# Altium schematic sheet Qunyin_mmWave_pmic.SchDoc: mmWave_iwr6843aop
size 457 x 292 mm; DrawnBy: Wxd; Organization: Shanghai Qunyin; Address1: Xianxia Rd 601; Address2: Changning district; Address3: Shanghai; DocumentNumber: 3; SheetNumber: 3; SheetTotal: 6
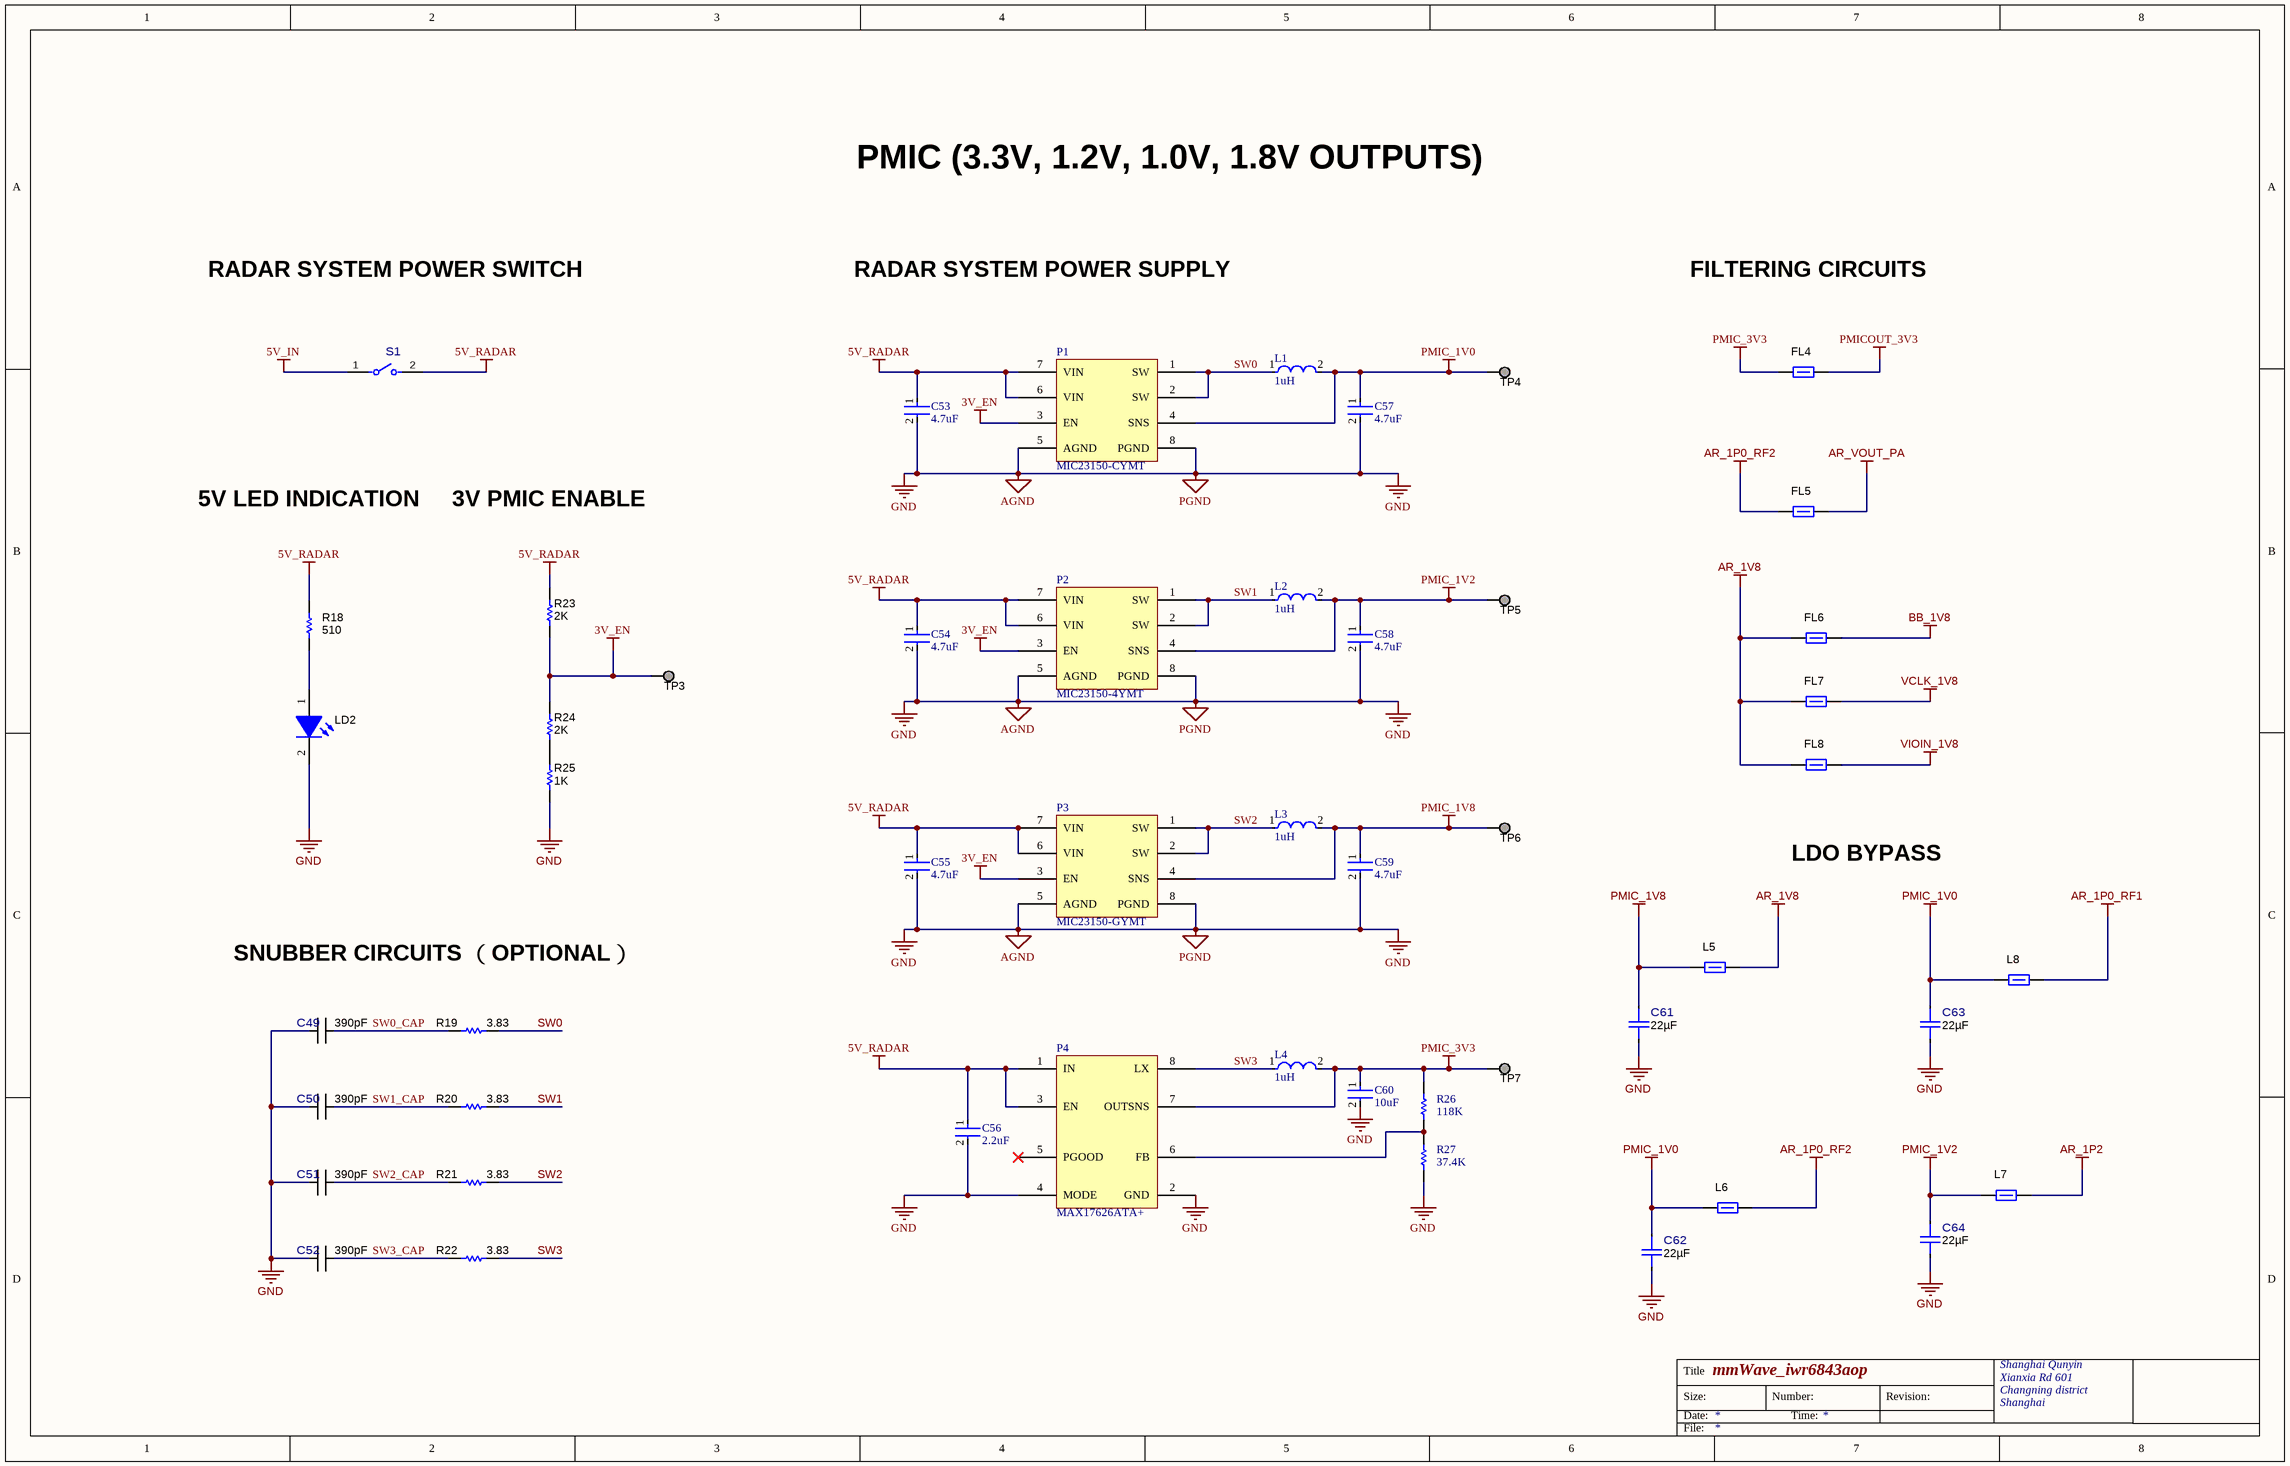
[diagram p0: Qunyin_mmWave_pmic.SchDoc]

## Parts
C49  Cap_F: 390pF  [FP-TMK063CG391JT-F_0201 (0603 Metric)-IPC_C]  (hidden comment: TMK063CG391JT-F)
C50  Cap_F: 390pF  [FP-TMK063CG391JT-F_0201 (0603 Metric)-IPC_C]  (hidden comment: TMK063CG391JT-F)
C51  Cap_F: 390pF  [FP-TMK063CG391JT-F_0201 (0603 Metric)-IPC_C]  (hidden comment: TMK063CG391JT-F)
C52  Cap_F: 390pF  [FP-TMK063CG391JT-F_0201 (0603 Metric)-IPC_C]  (hidden comment: TMK063CG391JT-F)
C53  Capacitance: 4.7uF  [FP-CL10-IPC_C]  (hidden comment: CL10B475KQ8NQNC)
C54  Capacitance: 4.7uF  [FP-CL10-IPC_C]  (hidden comment: CL10B475KQ8NQNC)
C55  Capacitance: 4.7uF  [FP-CL10-IPC_C]  (hidden comment: CL10B475KQ8NQNC)
C56  Capacitance: 2.2uF  [FP-GRM188-0_1-e0_2_0_5-MFG]  (hidden comment: GRM188R71A225KE15D)
C57  Capacitance: 4.7uF  [FP-CL10-IPC_C]  (hidden comment: CL10B475KQ8NQNC)
C58  Capacitance: 4.7uF  [FP-CL10-IPC_C]  (hidden comment: CL10B475KQ8NQNC)
C59  Capacitance: 4.7uF  [FP-CL10-IPC_C]  (hidden comment: CL10B475KQ8NQNC)
C60  capacitance: 10uF  [FP-GRM188-0_2-IPC_C]  (hidden comment: GRM188Z71A106KA73D)
C61  Cap_F: 22µF  [FP-CL05A226MQ5N6J8_0402-IPC_C]  (hidden comment: CL05A226MQ5N6J8)
C62  Cap_F: 22µF  [FP-CL05A226MQ5N6J8_0402-IPC_C]  (hidden comment: CL05A226MQ5N6J8)
C63  Cap_F: 22µF  [FP-CL05A226MQ5N6J8_0402-IPC_C]  (hidden comment: CL05A226MQ5N6J8)
C64  Cap_F: 22µF  [FP-CL05A226MQ5N6J8_0402-IPC_C]  (hidden comment: CL05A226MQ5N6J8)
FL4  BLM15PD300SZ1D  [0402L]  (value not drawn)
FL5  BLM15PD300SZ1D  [0402L]  (value not drawn)
FL6  BLM15PD300SZ1D  [0402L]  (value not drawn)
FL7  BLM15PD300SZ1D  [0402L]  (value not drawn)
FL8  BLM15PD300SZ1D  [0402L]  (value not drawn)
L1  Inductance: 1uH  [FP-LQH5BPB_T0-MFG]  (hidden comment: LQH5BPN1R0NT0L)
L2  Inductance: 1uH  [FP-LQH5BPB_T0-MFG]  (hidden comment: LQH5BPN1R0NT0L)
L3  Inductance: 1uH  [FP-LQH5BPB_T0-MFG]  (hidden comment: LQH5BPN1R0NT0L)
L4  Inductance: 1uH  [FP-LQH5BPB_T0-MFG]  (hidden comment: LQH5BPN1R0NT0L)
L5  BLM18SG260TN1D  [0603L]  (value not drawn)
L6  BLM18SG260TN1D  [0603L]  (value not drawn)
L7  BLM18SG260TN1D  [0603L]  (value not drawn)
L8  BLM18SG260TN1D  [0603L]  (value not drawn)
LD2  APHHS1005CGCK  [APHHS1005_Green]  (value not drawn)
P1  MIC23150-CYMT
P2  MIC23150-4YMT
P3  MIC23150-GYMT
P4  MAX17626ATA+
R18  value 510  [0201L]  (hidden comment: RC0201JR-07510RL)
R19  Res_ohm: 3.83  [FP-RC0402FR-073R83L_0402 (1005 Metric)-IPC_C]  (hidden comment: RC0402FR-073R83L)
R20  Res_ohm: 3.83  [FP-RC0402FR-073R83L_0402 (1005 Metric)-IPC_C]  (hidden comment: RC0402FR-073R83L)
R21  Res_ohm: 3.83  [FP-RC0402FR-073R83L_0402 (1005 Metric)-IPC_C]  (hidden comment: RC0402FR-073R83L)
R22  Res_ohm: 3.83  [FP-RC0402FR-073R83L_0402 (1005 Metric)-IPC_C]  (hidden comment: RC0402FR-073R83L)
R23  value 2K  [FP-RMCF0603-IPC_A]  (hidden comment: Stackpole Electronics RMCF0603FT2K00)
R24  value 2K  [FP-RMCF0603-IPC_A]  (hidden comment: Stackpole Electronics RMCF0603FT2K00)
R25  value 1K  [FP-RMCF0603-IPC_A]  (hidden comment: Samsung RC0603J102CS)
R26  value 118K  [FP-CRCW1206-e3-IPC_A]  (hidden comment: Vishay CRCW1206118KFKEA)
R27  value 37.4K  [FP-CRCW1206-e3-IPC_A]  (hidden comment: Panasonic ERJ-8ENF3742V)
S1  CHS-01TA  [FP-CHS-01TA_SMT_SW_5MM4_2MM5-MFG]  (value not drawn)
TP3  TESTPOINT  [TP_25MIL-SMT]  (value not drawn)  (no BOM)
TP4  TESTPOINT  [TP_25MIL-SMT]  (value not drawn)  (no BOM)
TP5  TESTPOINT  [TP_25MIL-SMT]  (value not drawn)  (no BOM)
TP6  TESTPOINT  [TP_25MIL-SMT]  (value not drawn)  (no BOM)
TP7  TESTPOINT  [TP_25MIL-SMT]  (value not drawn)  (no BOM)

## Nets
3V_EN: P1.3(EN) P2.3(EN) P3.3(EN) R23.1 R24.2 TP3.1
5V_IN: S1.1
5V_RADAR: C53.1 C54.1 C55.1 C56.1 P1.6(VIN) P1.7(VIN) P2.6(VIN) P2.7(VIN) P3.6(VIN) P3.7(VIN) P4.1(IN) P4.3(EN) R18.1 R23.2 S1.2
AGND: C49.2 C50.2 C51.2 C52.2 C53.2 C54.2 C55.2 C56.2 C57.2 C58.2 C59.2 C60.2 C61.2 C62.2 C63.2 C64.2 LD2.2(K) P1.5(AGND) P1.8(PGND) P2.5(AGND) P2.8(PGND) P3.5(AGND) P3.8(PGND) P4.2(GND) P4.4(MODE) R25.1 R27.1  [also labelled GND, PGND]
AR_1P0_RF1: L8.2
AR_1P0_RF2: FL5.1 L6.2
AR_1P2: L7.2
AR_1V8: FL6.1 FL7.1 FL8.1 L5.2
AR_VOUT_PA: FL5.2
BB_1V8: FL6.2
PMIC_1V0: C57.1 C62.1 C63.1 L1.2 L6.1 L8.1 P1.4(SNS) TP4.1
PMIC_1V2: C58.1 C64.1 L2.2 L7.1 P2.4(SNS) TP5.1
PMIC_1V8: C59.1 C61.1 L3.2 L5.1 P3.4(SNS) TP6.1
PMIC_3V3: C60.1 FL4.1 L4.2 P4.7(OUTSNS) R26.2 TP7.1
PMICOUT_3V3: FL4.2
VCLK_1V8: FL7.2
VIOIN_1V8: FL8.2
SW0: L1.1 P1.1(SW) P1.2(SW) R19.2
SW0_CAP: C49.1 R19.1
SW1: L2.1 P2.1(SW) P2.2(SW) R20.2
SW1_CAP: C50.1 R20.1
SW2: L3.1 P3.1(SW) P3.2(SW) R21.2
SW2_CAP: C51.1 R21.1
SW3: L4.1 P4.8(LX) R22.2
SW3_CAP: C52.1 R22.1
NetLD2_1: LD2.1(A) R18.2
NetP4_6: P4.6(FB) R26.1 R27.2
NetR24_1: R24.1 R25.2

Not connected (* = marked no-connect by the designer): P4 5(PGOOD)*

## Notes on the sheet
- PMIC (3.3V, 1.2V, 1.0V, 1.8V OUTPUTS)
- RADAR SYSTEM POWER SWITCH
- RADAR SYSTEM POWER SUPPLY
- FILTERING CIRCUITS
- 5V LED INDICATION
- 3V PMIC ENABLE
- LDO BYPASS
- SNUBBER CIRCUITS （OPTIONAL）
- Title
- Size:
- Date:
- Number:
- Time:
- Revision:
- File:

## Library data of the parts
C49-C52 = CMP-0086438-1: CAP CER 390PF 25V C0G/NP0 0201; Manufacturer: Taiyo Yuden; AEC Qualified: No; SizeZ_mm: 0.33mm; Symbol Name: SYM-TMK063CG391JT-F; TempCo: 30ppm/°C; Tolerance_%: 5%; RoHS: TRUE; ComponentLink1Description: Datasheet; ComponentLink1URL: https://ds.yuden.co.jp/TYCOMPAS/ut/download?pn=TMK063CG391JT-F+&fileType=CA; PackageReference: 0201 (0603 Metric); PartNumber: TMK063CG391JT-F; VDC_V: 25V
C53-C55 C57-C59 = CMP-2000-06096-2: CAP CER 4.7UF 6.3V X7R 0603; Manufacturer: Samsung; Tolerance: 10%; Material: Ceramic; Temperature Coefficient: 15%; Device Class L3: Ceramic Capacitors; Temperature Characteristic: X7R; Automotive: No; Package: CL10; Device Class L2: Capacitors; Octopart: https://octopart.com/cl10b475kq8nqnc-samsung-24957976; ComponentLink2Description: Datasheet; Temperature Range High: +125°C; Lead Free: Yes; Height: 0.95mm; Temperature: -55°C to +125°C; Ipc Land Pattern Name: CAPC16080X80; Temperature Range Low: -55°C; Digikey Description: CAP CER 4.7UF 6.3V X7R 0603; Mouser Description: C Series 0402 4.7 uF 6.3 V ±20 % Tolerance X5R SMT Multilayer Ceramic Capacitor; Category: Cap; ComponentLink2URL: http://www.samsungsem.com/kr/support/product-search/mlcc/__icsFiles/afieldfile/2018/07/24/CL10B475KQ8NQNC.pdf; Value: 4.7uF; Voltage Rating: 6.3V; Manufacturer Part Number: CL10B475KQ8NQNC; Device Class L1: Passive Components; RoHS: TRUE
C56 = CMP-2006-02836-2: Chip Multilayer Ceramic Capacitors for General Purpose, 0603, 2.2uF, X7R, 15%, 10%, 10V; Case Code (Metric): 1608; Height: 0.8mm; Packaging: Cut Tape; Voltage: 10V; Lead Free: Lead Free; Min Operating Temperature: -55°C; Voltage Rating (DC): 10V; Max Operating Temperature: 125°C; Voltage Rating: 10V; Dielectric: X7R; Depth: 0.8mm; Case Code (Imperial): 0603; Termination: SMD/SMT; Case/Package: 0603; Number of Pins: 2; REACH SVHC: No SVHC; Mount: Surface Mount; Width: 0.031inch; Material: Ceramic; Package Quantity: 1; Weight: 7.1E-05oz; Length: 1.6mm; Thickness: 0.035inch; Tolerance: 10%
C60 = CMP-06035-000049-2: Chip Multilayer Ceramic Capacitors for General Purpose, 0603, 10uF, X7R, 15%, 10%, 10V
C61-C64 = CMP-0089043-3: CAP CER 22UF 6.3V X5R 0402; Manufacturer: Samsung Electro-Mechanics; TempCo: 15%; AEC Qualified: No; Tolerance_%: 20%; SizeZ_mm: 0.55mm; ComponentLink1URL: http://www.samsungsem.com/kr/support/library/product-catalog/__icsFiles/afieldfile/2018/11/28/MLCC.pdf; RoHS: TRUE; PartNumber: CL05A226MQ5N6J8; ComponentLink1Description: Datasheet; PackageReference: 0402; VDC_V: 6.3V; ValueDisplayed: 22uF; Part Number: CL05A226MQ5N6J8
FL4-FL8 = CMP-0078934-1: Inductor, Ferrite Bead, Ferrite, 2.2 A, 0.035 ohm, AEC-Q200 Grade 1, SMD; Manufacturer: MuRata; AEC Category: Q200; AEC Grade: 1; AEC Qualified: Y; DCR_ohm: 0.035; Imax_A: 2.2A; SizeArea_mm2: 0.5; SizeAreaWB_mm2: 3; SizeZ_mm: 0.6; RoHS: Y; ComponentLink1Description: Datasheet link; ComponentLink1URL: https://www.murata.com/en-us/products/productdata/8796748677150/QNFA9118.pdf; CompType: Inductor; LatestRevisionDate: 2017-12-07; Material: Ferrite; MountType: SMT; PackageReference: 0402; PartNumber: BLM15PD300SZ1D; Published: 2008-06-26; Publisher: Texas Instruments; SizeX_mm: 1; SizeY_mm: 0.5; Supplier 1: Digi-Key; Supplier 2: Mouser; Supplier Part Number 1: 490-16506-1-ND; Supplier Part Number 2: 81-BLM15PD300SZ1D; Technology: Ferrite Bead; Value1: 0.035 ohm; Value2: 2.2A
L1-L4 = CMP-06042-011330-1: Wire Wound Ferrite Inductor for Power Lines 1μH ±30% 0.0228Ω 3.1A 2020; Max DC Current: 5.8A; Test Frequency: 100kHz; Self Resonant Frequency: 90MHz; Shielding: Shielded; DC Resistance (DCR): 19mR; Tolerance: 30%; Resistor Type: Wirewound; Max Operating Temperature: 85°C; Inductance Tolerance: 30%; Case/Package: 2020; Lead Free: Lead Free; Mount: Surface Mount; Core Material: Ferrite; Military Standard: Not; Termination: SMD/SMT; Case Code (Imperial): 2020; Min Operating Temperature: -40°C; Length: 0.197inch; Package Quantity: 500; Height - Seated (Max): 0.086inch; Height: 2mm; Case Code (Metric): 5050; Width: 0.197inch; Depth: 5.2mm; REACH SVHC: No SVHC; Saturation Current: 5.8A; Packaging: Tape and Reel; Current Rating: 3.1A; DC Current: 3.1A
  L1: Parameter 1: *
L5-L8 = CMP-0003354-2: Ferrite Bead, 26 ohm @ 100 MHz, 6 A, 0603; Manufacturer: MuRata; ZTyp@100MHz_Ohm: 26; SizeAreaWB_mm2: 4.68; DCR_ohm: 7m; Value1: 0.007 ohm; Value: 26 ohm; Imax_A: 6A; SizeZ_mm: 1; SizeX_mm: 1.6; SizeY_mm: 0.8; SizeArea_mm2: 1.28; ComponentLink1URL: http://search.murata.co.jp/Ceramy/image/img/PDF/ENG/L0110S0100BLM18S.pdf; Supplier Part Number 2: 73M9124; Publisher: Texas Instruments; Supplier 2: Newark; Supplier Part Number 3: 81-BLM18SG260TN1D; Supplier 3: Mouser; Published: 2014-04-30; RoHS: Y; MountType: SMT; Supplier 1: Digi-Key; PackageReference: 0603; Value2: 6A; CompType: Ferrite Bead; LatestRevisionDate: 2017-03-09; PartNumber: BLM18SG260TN1D; ComponentLink1Description: Datasheet link; Supplier Part Number 1: 490-3995-1-ND; ValueDisplayed: 26 ohm
LD2 = CMP-0067682-2: LED, Green, SMD; Manufacturer: Kingbright; Angle: 120.0; Power_TotalModule: 75mW; SizeZ_mm: 0.6; Vf_V: 2.1V; Vr_V: 5V; Io_A: 20mA; Ir_A: 10µA; SizeArea_mm2: 0.5; SizeAreaWB_mm2: 3.0; SizeX_mm: 1.0; Tjmax_C: 85°C; Value1: 0.075W; RoHS: Y; Color: Green; ComponentLink1Description: Datasheet link; ComponentLink1URL: http://www.kingbrightusa.com/images/catalog/SPEC/APHHS1005CGCK.pdf; PackageReference: 0402; PartNumber: APHHS1005CGCK; CompType: LED; MountType: SMT; SizeY_mm: 0.5; Type: ?; Value2: 2.1V; Value: Green
P1 = MIC23150-CYMT: pmic 1V 2A 4MHz
P2 = MIC23150-4YMT: pmic 1.2V 2A 4MHz
P3 = MIC23150-GYMT: pmic 1.8V 2A 4MHz
P4 = MAX17626: IC 3.3V Adj Out Dc-dc Tdfn; Manufacturer: Analog Devices; Supplier 1: DigiKey; Supplier Part Number 1: 175-MAX17626ATA+-ND; Manufacturer Part Number: MAX17626ATA+
R18 = CMP-0027137-1: RES, 510, 5%, 0.05 W, 0201; Manufacturer: Yageo America; AEC Category: Q200; AEC Qualified: N; EIA_Code: E24; Power_W: 50mW; SizeArea_mm2: 0.18; SizeX_mm: 0.6; SizeY_mm: 0.3; SizeZ_mm: 0.26; TempCo: 200 ppm/C; U/M: EA; Value2: 0.05W; Value_Code: 510R; VDC_V: 25V; RoHS: Y; AEC Grade: N/A; ComponentLink1Description: Datasheet link; ComponentLink1URL: http://www.yageo.com/documents/recent/PYu-RC_Group_51_RoHS_L_5.pdf; CompType: Resistor; LatestRevisionDate: 2017-03-09; MountType: SMT; PackageReference: 0201; PartNumber: RC0201JR-07510RL; Published: 2016-10-14; Publisher: Texas Instruments; Res_ohm: 510; Supplier 1: Digi-Key; Supplier 2: Mouser; Supplier Part Number 1: YAG2907CT-ND; Supplier Part Number 2: 603-RC0201JR-07510RL; Technology: Thick Film; Tolerance_%: 5%; Value1: 5%; ValueDisplayed: 510
R19-R22 = CMP-0086444-2: RES Thick Film SMD 3.83Ω 1% 1/16W 0402 200ppm/°C; Manufacturer: Yageo; AEC Qualified: No; Power_W: 63mW; VDC_V: 50V; SizeZ_mm: 0.4mm; ComponentLink1Description: Datasheet; PackageReference: 0402 (1005 Metric); TempCo: 200ppm/°C; RoHS: TRUE; Technology: Thick Film; PartNumber: RC0402FR-073R83L; ComponentLink1URL: http://www.yageo.com/documents/recent/PYu-RC_Group_51_RoHS_L_10.pdf; Tolerance_%: 1%
R23 R24 = Resistor: Res Thick Film 0603 2K Ohm 1% 0.1W(1/10W) ±100ppm/C Pad SMD Automotive T/R; Resistance: 2kR; Power Rating: 100mW; Temperature Coefficient: 100ppm/°C; Working Voltage: 75V; Supplier 1: Arrow Electronics; Supplier Part Number 1: RMCF0603FT2K00; Manufacturer: Stackpole Electronics; Manufacturer Part Number: RMCF0603FT2K00; RoHS: Yes; Category: Chip SMD Resistors; Stock 1: 210000; Pricing 1: 5000=0.00220, 10000=0.00210, 25000=0.00180 (USD); Mount: Surface Mount; Case/Package: 0603; Case Code (Metric): 1608; Case Code (Imperial): 0603; Contact Plating: Tin,Matte; Min Operating Temperature: -55°C; Max Operating Temperature: 155°C; Tolerance: 1%; Packaging: Tape and Reel; Resistor Type: Thick Film; Number of Terminations: 2; Max Power Dissipation: 100mW; Features: Automotive AEC-Q200; Series: RMCF; Technology: THICK FILM; Construction: Rectangular; Length: 1.55mm; Width: 0.031inch; Height: 0.022inch; Depth: 0.8mm; Radiation Hardening: No; Military Standard: Not; Lead Free: Lead Free; RoHS Compliant: Yes; ComponentLink1URL: https://datasheet.ciiva.com/15193/getdatasheetpartid-362041-15193463.pdf?src-supplier=Verical; ComponentLink1Description: https://datasheet.ciiva.com/15193/getdatasheetpartid-362041-15193463.pdf?src-supplier=Verical
R25 = Resistor: Res Thick Film 0201 1K Ohm 5% 0.05W(1/20W) ±250ppm/C Pad SMD T/R; Resistance: 1kR; Temperature Coefficient: 200ppm/°C; Power Rating: 50mW; Supplier 1: Arrow Electronics; Supplier Part Number 1: RC0603J102CS; Manufacturer: Samsung; Manufacturer Part Number: RC0603J102CS; RoHS: Yes; Category: Chip SMD Resistors; Stock 1: 11797; Pricing 1: 1=0.04340, 10=0.01620, 50=0.01600, 100=0.00940, 250=0.00640, 1000=0.00380, 3000=0.00350, 6000=0.00330 (USD); Case/Package: 0201; Contact Plating: Tin; Case Code (Metric): 0603; Case Code (Imperial): 0201; Size Code: 0201; Min Operating Temperature: -55°C; Max Operating Temperature: 125°C; Tolerance: 5%; Resistor Type: Thick Film; Packaging: Tape and Reel; Number of Terminations: 2; Max Power Dissipation: 50mW; Features: Moisture Resistant; Series: RC; Construction: Rectangular; Length: 0.024inch; Width: 0.012inch; Height: 0.01inch; Depth: 0.3mm; Radiation Hardening: No; Military Standard: Not; RoHS Compliant: Yes; ComponentLink1URL: https://datasheet.ciiva.com/26134/chip-resistor-150112-1-26134188.pdf?src-supplier=Digi-Key; ComponentLink1Description: https://datasheet.ciiva.com/26134/chip-resistor-150112-1-26134188.pdf?src-supplier=Digi-Key
R26 = Resistor: Res Thick Film 1206 118K Ohm 1% 1/4W ±100ppm/°C Molded SMD SMD Paper T/R; Power Rating: 250mW; Resistance: 118kR; Voltage Rating: 200V; Supplier 1: Newark; Supplier Part Number 1: 28W4162; Manufacturer: Vishay; Manufacturer Part Number: CRCW1206118KFKEA; RoHS: Yes; Category: Chip SMD Resistors; Stock 1: 283; Pricing 1: 10=0.09700, 25=0.07700, 50=0.05700, 100=0.03700 (USD); Case/Package: 1206; Number of Pins: 2; Case Code (Metric): 3216; Case Code (Imperial): 1206; Contact Plating: Tin; Weight: 0.000353oz; Size Code: 1206; Min Operating Temperature: -55°C; Max Operating Temperature: 155°C; Tolerance: 1%; Packaging: Tape and Reel; Resistor Type: Thick Film; Temperature Coefficient: 100ppm/°C; Series: CRCW; Number of Terminations: 2; Max Power Dissipation: 250mW; Voltage Rating (DC): 200V; Package Quantity: 10; Termination: SMD/SMT; Resistance Tolerance: 1%; Features: Automotive AEC-Q200; Construction: Rectangular; Length: 3.2mm; Width: 0.063inch; Height: 0.024inch; Depth: 1.6mm; Radiation Hardening: No; RoHS Compliant: Yes; REACH SVHC: Unknown; Lead Free: Lead Free; Military Standard: Not; ComponentLink1URL: https://datasheet.ciiva.com/5542/dcrcwe3-109170-5542060.pdf?src-supplier=Mouser; ComponentLink1Description: https://datasheet.ciiva.com/5542/dcrcwe3-109170-5542060.pdf?src-supplier=Mouser; ComponentLink2URL: https://datasheet.ciiva.com/8976/dcrcwe3-8976345.pdf?src-supplier=Avnet; ComponentLink2Description: https://datasheet.ciiva.com/8976/dcrcwe3-8976345.pdf?src-supplier=Avnet; ComponentLink3URL: https://datasheet.ciiva.com/2497/dcrcwe3-2497327.pdf?src-supplier=Digi-Key; ComponentLink3Description: https://datasheet.ciiva.com/2497/dcrcwe3-2497327.pdf?src-supplier=Digi-Key; ComponentLink4URL: https://datasheet.ciiva.com/2497/dcrcwe3-2497328.pdf?src-supplier=Digi-Key; ComponentLink4Description: https://datasheet.ciiva.com/2497/dcrcwe3-2497328.pdf?src-supplier=Digi-Key; ComponentLink5URL: https://datasheet.ciiva.com/2497/dcrcwe3-2497329.pdf?src-supplier=Digi-Key; ComponentLink5Description: https://datasheet.ciiva.com/2497/dcrcwe3-2497329.pdf?src-supplier=Digi-Key; ComponentLink6URL: https://datasheet.ciiva.com/7800/125364-7800553.pdf?src-supplier=Element14; ComponentLink6Description: https://datasheet.ciiva.com/7800/125364-7800553.pdf?src-supplier=Element14; ComponentLink7URL: https://datasheet.ciiva.com/22675/1847332-22675213.pdf?src-supplier=Element14; ComponentLink7Description: https://datasheet.ciiva.com/22675/1847332-22675213.pdf?src-supplier=Element14; ComponentLink8URL: https://datasheet.ciiva.com/7714/1697337-7714310.pdf?src-supplier=Element14; ComponentLink8Description: https://datasheet.ciiva.com/7714/1697337-7714310.pdf?src-supplier=Element14; ComponentLink9URL: https://datasheet.ciiva.com/7714/1697337-7714311.pdf?src-supplier=Element14; ComponentLink9Description: https://datasheet.ciiva.com/7714/1697337-7714311.pdf?src-supplier=Element14
R27 = Resistor: Res Thick Film 1206 37.4K Ohm 1% 1/4W ±100ppm/°C Molded SMD Punched Carrier T/R; Resistance: 37.4kR; Power Rating: 250mW; Voltage Rating (DC): 200V; Supplier 1: Arrow Electronics; Supplier Part Number 1: ERJ-8ENF3742V; Manufacturer: Panasonic; Manufacturer Part Number: ERJ-8ENF3742V; RoHS: Yes; Category: Chip SMD Resistors; Stock 1: 4646; Pricing 1: 1=0.05350, 10=0.02360, 100=0.01330, 500=0.01070, 1000=0.00720, 5000=0.00710 (USD); Mount: Surface Mount; Case/Package: 1206; Case Code (Metric): 3216; Case Code (Imperial): 1206; Contact Plating: Tin; Min Operating Temperature: -55°C; Max Operating Temperature: 155°C; Tolerance: 1%; Packaging: Tape and Reel; Temperature Coefficient: 100ppm/°C; Series: ERJ; Resistor Type: Thick Film; Voltage Rating: 200V; Number of Terminations: 2; Max Power Dissipation: 250mW; Package Quantity: 1; Features: Automotive AEC-Q200; Construction: Rectangular; Resistance Tolerance: 1%; Length: 3.2mm; Width: 0.063inch; Height: 0.028inch; Depth: 1.6mm; Radiation Hardening: No; RoHS Compliant: Yes; Lead Free: Lead Free; Military Standard: Not; REACH SVHC: Yes; ComponentLink1URL: https://datasheet.ciiva.com/22721/1678782-22721375.pdf?src-supplier=Farnell; ComponentLink1Description: https://datasheet.ciiva.com/22721/1678782-22721375.pdf?src-supplier=Farnell; ComponentLink2URL: https://datasheet.ciiva.com/22668/1678782-22668220.pdf?src-supplier=Element14; ComponentLink2Description: https://datasheet.ciiva.com/22668/1678782-22668220.pdf?src-supplier=Element14; ComponentLink3URL: https://datasheet.ciiva.com/22736/1678782-22736422.pdf?src-supplier=Element14; ComponentLink3Description: https://datasheet.ciiva.com/22736/1678782-22736422.pdf?src-supplier=Element14; ComponentLink4URL: https://datasheet.ciiva.com/46419/1678782-46419967.pdf?src-supplier=Element14; ComponentLink4Description: https://datasheet.ciiva.com/46419/1678782-46419967.pdf?src-supplier=Element14; ComponentLink5URL: https://datasheet.ciiva.com/24029/aoa0000ce2-24029820.pdf?src-supplier=Mouser; ComponentLink5Description: https://datasheet.ciiva.com/24029/aoa0000ce2-24029820.pdf?src-supplier=Mouser; ComponentLink6URL: https://datasheet.ciiva.com/9190/aoa0000ce2-9190159.pdf?src-supplier=Avnet; ComponentLink6Description: https://datasheet.ciiva.com/9190/aoa0000ce2-9190159.pdf?src-supplier=Avnet
S1 = CMP-0087181-1: SWITCH SLIDE DIP SPST 100MA 6V; Manufacturer: Nidec Copal Electronics; PositionCount: 1; SizeZ_mm: 2.5mm; Symbol Name: SYM-CHS-01TA; RoHS: TRUE; Circuit: SPST; ComponentLink1Description: Datasheet; ComponentLink1URL: https://www.nidec-copal-electronics.com/e/catalog/switch/chs.pdf; MountType: Surface Mount; PackageReference: SMT_SW_5MM4_2MM5; PartNumber: CHS-01TA; VDC_V: 6V
TP3-TP7 = CMP-0078143-3: TEST POINT.  No entry in BOM.; CompType: Testpoint; Manufacturer: N/A; PackageReference: N/A; PartNumber: N/A; Library Reference: TESTPOINT